# Altium schematic sheet led_em_kian_220v_v2_SWITCHING.SchDoc
size 381 x 292 mm
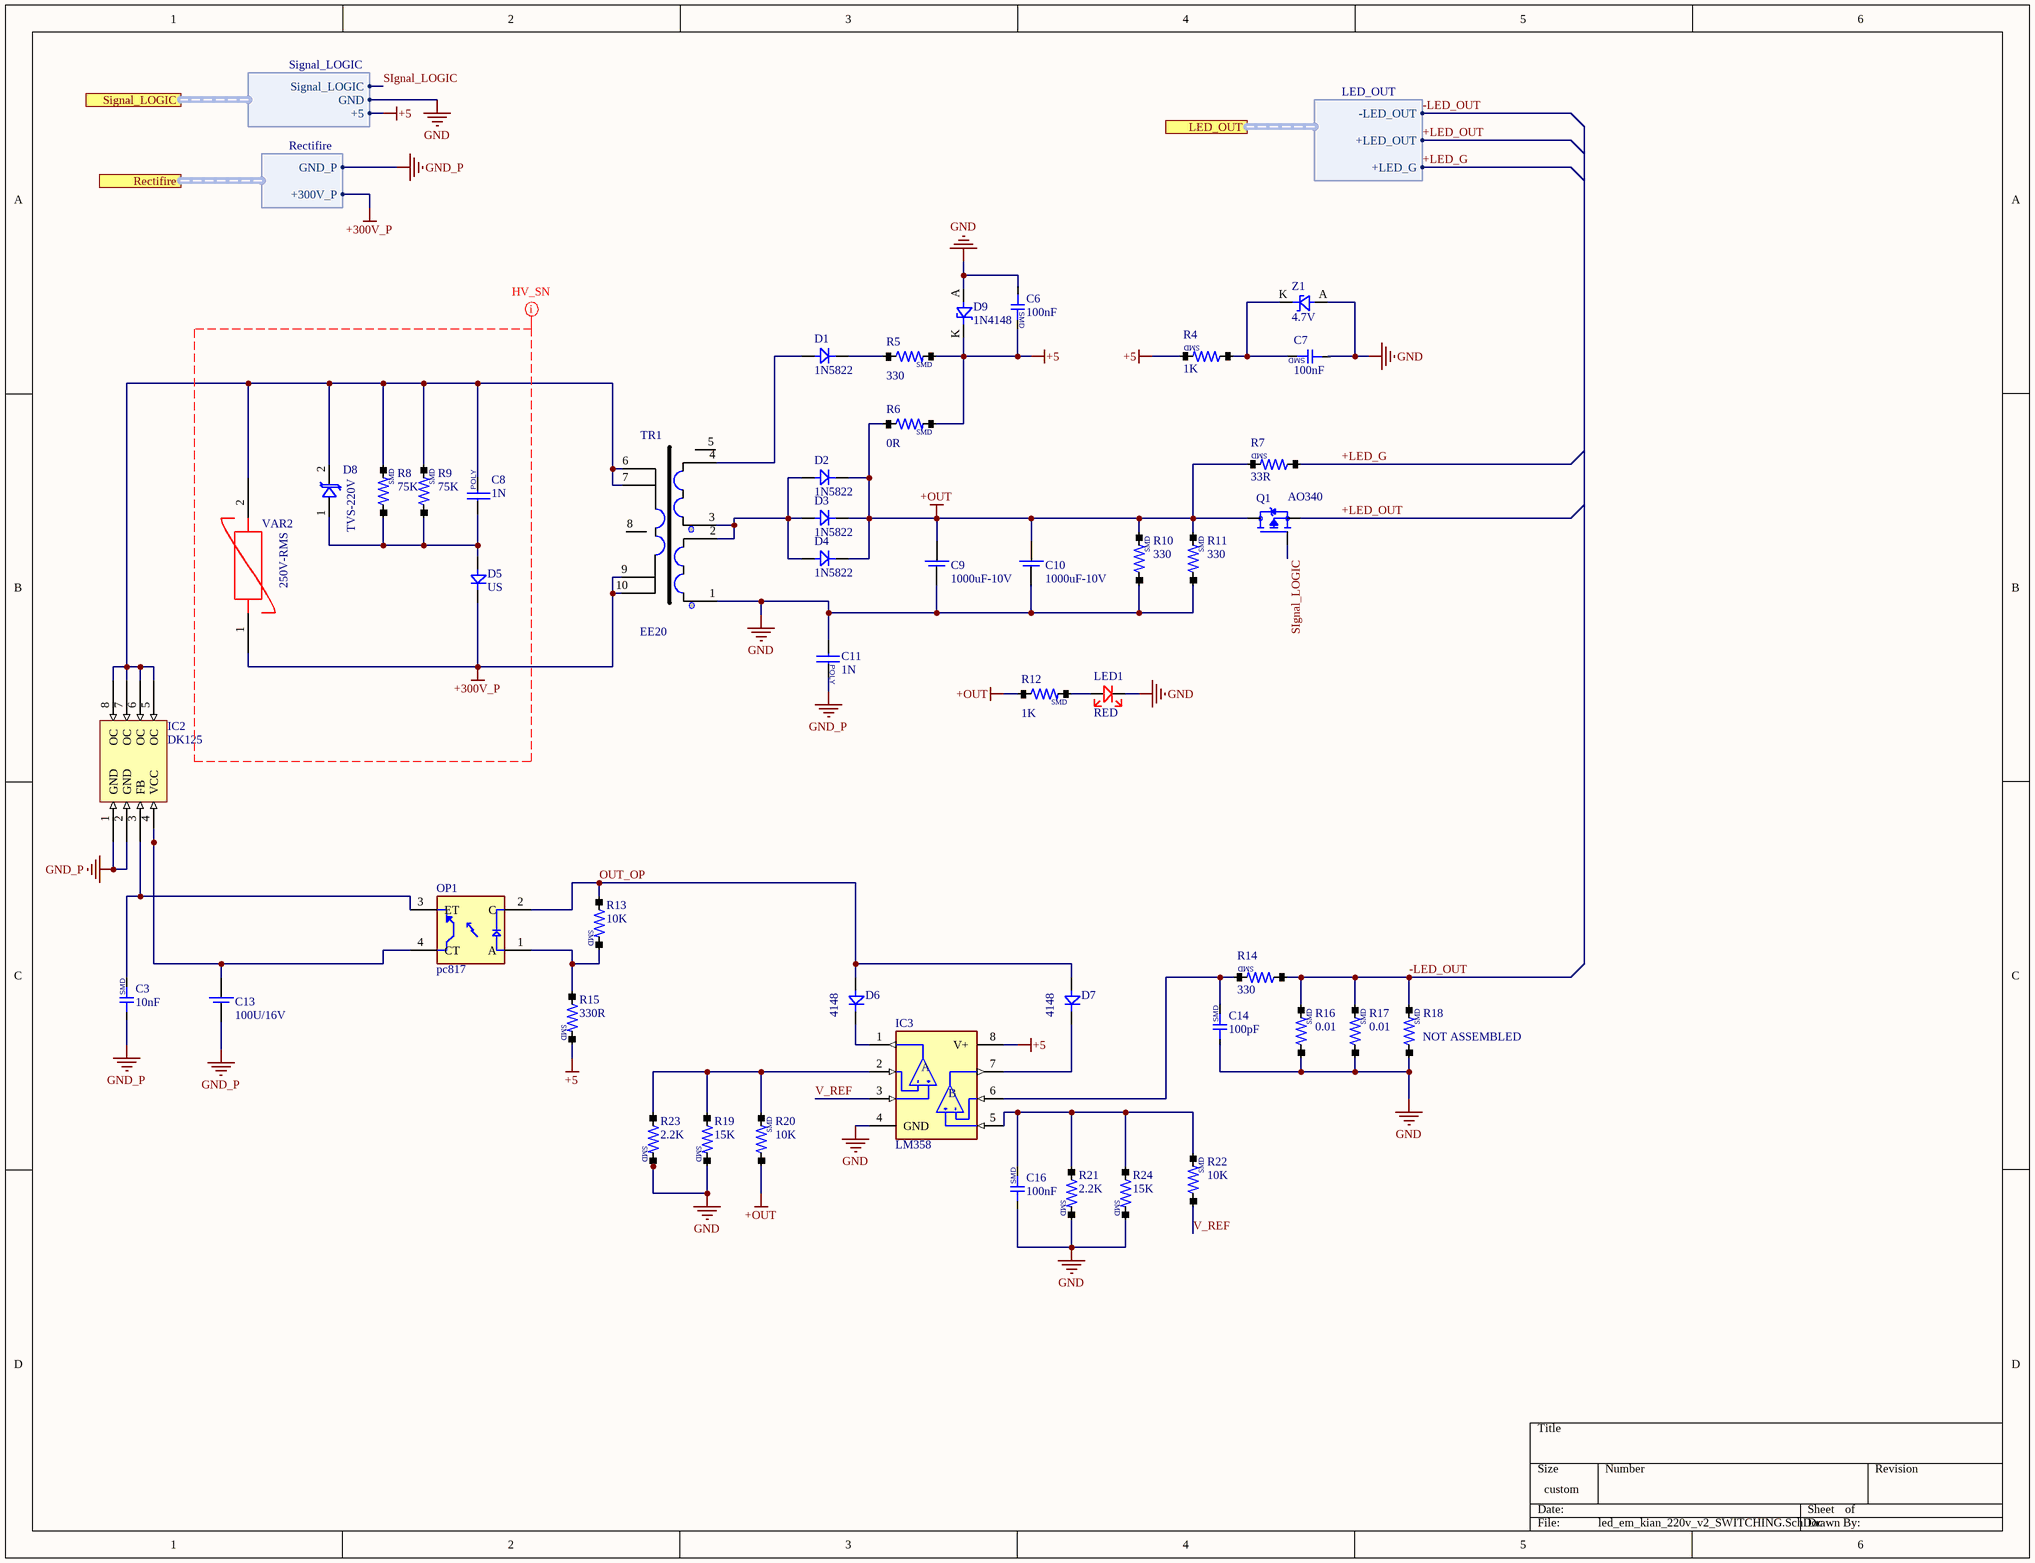
[diagram p0: led_em_kian_220v_v2_SWITCHING.SchDoc]

## Parts
C3  10nF  [CAP-0805]
C6  100nF  [CAP-0805]
C7  100nF  [CAP-0805]
C8  1N  [CAP/100nF/275V/poly]
C9  1000uF-10V  [cap/330u/16v]
C10  1000uF-10V  [cap/330u/16v]
C11  1N  [CAP/100nF/275V/poly]
C13  100U/16V  [cap/330u/16v]
C14  100pF  [CAP-0805]
C16  100nF  [CAP-0805]
D1  1N5822  [DIOD/1N4007/SMD]
D2  1N5822  [DIOD/1N4007/SMD]
D3  1N5822  [DIOD/1N4007/DIP]
D4  1N5822  [DIOD/1N4007/SMD]
D5  US  [DIOD/1N4007/SMD]
D6  4148  [DIOD/1N4007/SMD]
D7  4148  [DIOD/1N4007/SMD]
D8  TVS-220V  [TVS-5V-SMD]
D9  1N4148  [DIOD/RS1J]
IC2  DK125  [DIP8]
IC3  LM358  [SOP-8]
LED1  RED  [LED/0805]
OP1  pc817  [pc817]
Q1  AO340  [AO3401A]
R4  1K  [RES/0805]
R5  330  [RES/0805]
R6  0R  [RES/0805]
R7  33R  [RES/1206]
R8  75K  [RES/1206]
R9  75K  [RES/1206]
R10  330  [RES/0805]
R11  330  [RES/0805]
R12  1K  [RES/0805]
R13  10K  [RES/0805]
R14  330  [RES/0805]
R15  330R  [RES/0805]
R16  0.01  [RES/1206]
R17  0.01  [RES/1206]
R18  NOT ASSEMBLED  [RES/1206]
R19  15K  [RES/0805]
R20  10K  [RES/0805]
R21  2.2K  [RES/0805]
R22  10K  [RES/0805]
R23  2.2K  [RES/0805]
R24  15K  [RES/0805]
TR1  EE20  [TRANS_KARA]
VAR2  250V-RMS  [varistor]
Z1  4.7V  [DIOD/RS1J]

## Ports
LED_OUT (harness LED_OUT), Rectifire (harness Rectifire), Signal_LOGIC (harness Signal_LOGIC)

## Harnesses
Signal_LOGIC: +5, GND, Signal_LOGIC
Rectifire: +300V_P, GND_P
LED_OUT: +LED_G, +LED_OUT, -LED_OUT

## Nets
+5: C6.2 D9.K IC3.8(V+) R4.2 R5.2 R6.2 R15.2 ; port Signal_LOGIC.+5
+300V_P: D5.K TR1.9 TR1.10 VAR2.1 ; port Rectifire.+300V_P
+OUT: C9.+ C10.+ D2.K D3.K D4.K Q1.D R6.1 R7.2 R10.2 R11.2 R12.1 R20.1
GND: C6.1 C7.1 C9.- C10.- C11.1 C14.1 C16.1 D9.A IC3.4(GND) LED1.A R10.1 R11.1 R16.1 R17.1 R18.1 R19.2 R21.2 R23.2 R24.2 TR1.1 Z1.A ; port Signal_LOGIC.GND
GND_P: C3.1 C11.2 C13.- IC2.1(GND) IC2.2(GND) ; port Rectifire.GND_P
+LED_G: R7.1 ; port LED_OUT.+LED_G
+LED_OUT: Q1.S ; port LED_OUT.+LED_OUT
-LED_OUT: R14.1 R16.2 R17.2 R18.2 ; port LED_OUT.-LED_OUT
OUT_OP: D6.A D7.A OP1.2(C) R13.1
SIgnal_LOGIC: Q1.G ; port Signal_LOGIC.Signal_LOGIC
V_REF: IC3.3(+INA) R22.1
NetC3_2: C3.2 IC2.3(FB) OP1.3(ET)
NetC7_2: C7.2 R4.1 Z1.K
NetC8_1: C8.1 D5.A D8.1 R8.1 R9.1
NetC8_2: C8.2 D8.2 IC2.5(OC) IC2.6(OC) IC2.7(OC) IC2.8(OC) R8.2 R9.2 TR1.6 TR1.7 VAR2.2
NetC13_+: C13.+ IC2.4(VCC) OP1.4(CT)
NetC14_2: C14.2 IC3.6(-INB) R14.2
NetC16_2: C16.2 IC3.5(+INB) R21.1 R22.2 R24.1
NetD1_A: D1.A TR1.4
NetD1_K: D1.K R5.1
NetD2_A: D2.A D3.A D4.A TR1.2 TR1.3
NetD6_K: D6.K IC3.1(OUTA)
NetD7_K: D7.K IC3.7(OUTB)
NetIC3_2: IC3.2(-INA) R19.1 R20.2 R23.1
NetLED1_K: LED1.K R12.2
NetOP1_1: OP1.1(A) R13.2 R15.1

Not connected (* = marked no-connect by the designer): TR1 5(0) 8(0)

## Layout directives
net class SN: +300V_P

## Notes on the sheet
- (in symbol cap-poly) POLY
- (in symbol cap_smd) SMD
- (in symbol LM358) A; B
- (in symbol RES/SMD) SMD

## Library data of the parts
C3 C6 C7 C14 C16 = cap_smd
C8 C11 = cap-poly
C9 C10 C13 = cap-electrolit
D1-D7 = DIOD/RECTIFIERS
D8 = TVS-SMD
D9 Z1 = zener-0.5w
LED1 = LED-1COLER
Q1 = MOSFET_P_CH
R4-R24 = RES/SMD
TR1 = TRANS_KARA
VAR2 = varistor